# Altium project MCU_board.PrjPcb
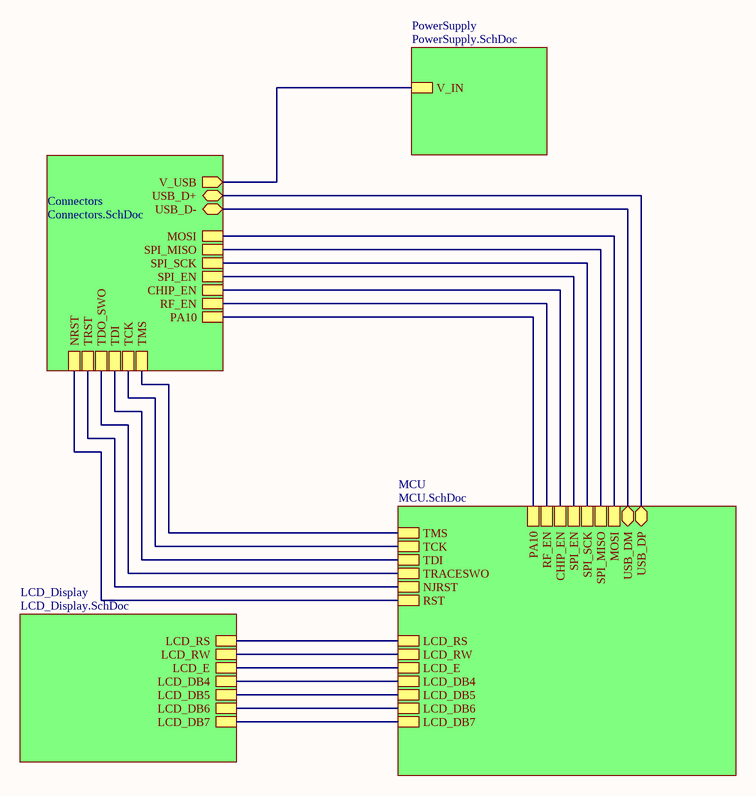
[diagram p0: Board.SchDoc]
5 sheets, 28 parts. Net scope: hierarchical (ports join the sheet entries above them; power ports are global).
Board file: MCU_Board.PcbDoc
Sheets:
  Board.SchDoc
    Connectors = Connectors.SchDoc
    LCD_Display = LCD_Display.SchDoc
    MCU = MCU.SchDoc
    PowerSupply = PowerSupply.SchDoc

## Sheet Board.SchDoc
size A4; SheetNumber: 1; SheetTotal: 5

### Sub-sheets
Connectors = Connectors.SchDoc: USB_D+ (bidir), USB_D- (bidir), V_USB (out), TMS, TCK, TDI, TDO_SWO, TRST, NRST, MOSI, SPI_MISO, SPI_SCK, SPI_EN, CHIP_EN, RF_EN, PA10
LCD_Display = LCD_Display.SchDoc: LCD_RS, LCD_RW, LCD_E, LCD_DB4, LCD_DB6, LCD_DB5, LCD_DB7
MCU = MCU.SchDoc: USB_DM (bidir), USB_DP (bidir), TMS, TCK, TDI, TRACESWO, NJRST, RST, LCD_RS, LCD_RW, LCD_E, LCD_DB4, LCD_DB6, LCD_DB5, LCD_DB7, MOSI, SPI_MISO, SPI_SCK, SPI_EN, CHIP_EN, RF_EN, PA10
PowerSupply = PowerSupply.SchDoc: V_IN

### Nets
USB_N: sheet Connectors/USB_D-, sheet MCU/USB_DM
USB_P: sheet Connectors/USB_D+, sheet MCU/USB_DP
NetC1_2: sheet Connectors/NRST, sheet MCU/RST
NetC13_2: sheet Connectors/V_USB, sheet PowerSupply/V_IN
NetJ1_3: sheet Connectors/TRST, sheet MCU/NJRST
NetJ1_5: sheet Connectors/TDI, sheet MCU/TDI
NetJ1_7: sheet Connectors/TMS, sheet MCU/TMS
NetJ1_9: sheet Connectors/TCK, sheet MCU/TCK
NetJ1_13: sheet Connectors/TDO_SWO, sheet MCU/TRACESWO
NetJ2_1: sheet Connectors/SPI_EN, sheet MCU/SPI_EN
NetJ2_2: sheet Connectors/CHIP_EN, sheet MCU/CHIP_EN
NetJ2_3: sheet Connectors/SPI_SCK, sheet MCU/SPI_SCK
NetJ2_4: sheet Connectors/RF_EN, sheet MCU/RF_EN
NetJ2_5: sheet Connectors/SPI_MISO, sheet MCU/SPI_MISO
NetJ2_6: sheet Connectors/PA10, sheet MCU/PA10
NetJ2_7: sheet Connectors/MOSI, sheet MCU/MOSI
NetU1_3: sheet LCD_Display/LCD_RS, sheet MCU/LCD_RS
NetU1_4: sheet LCD_Display/LCD_RW, sheet MCU/LCD_RW
NetU1_5: sheet LCD_Display/LCD_E, sheet MCU/LCD_E
NetU1_6: sheet LCD_Display/LCD_DB4, sheet MCU/LCD_DB4
NetU1_7: sheet LCD_Display/LCD_DB5, sheet MCU/LCD_DB5
NetU1_8: sheet LCD_Display/LCD_DB6, sheet MCU/LCD_DB6
NetU1_9: sheet LCD_Display/LCD_DB7, sheet MCU/LCD_DB7

## Sheet Connectors.SchDoc
size A4; SheetNumber: 2; SheetTotal: 5
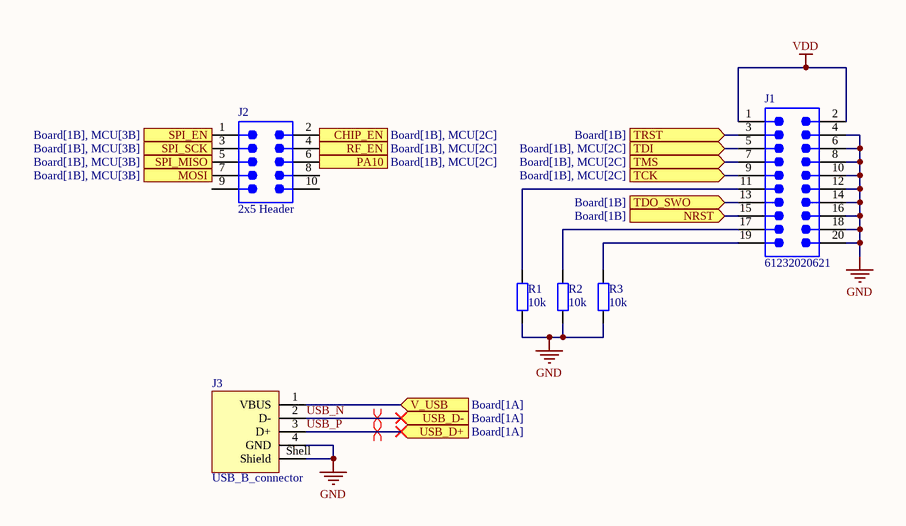
[diagram p1: Connectors.SchDoc]

### Parts
J1  61232020621  [61232020621]
J2  2x5 Header  [SMTC-MMT-105-01-X-DH]
J3  USB_B_connector  [62910416121]
R1  10k  [Res_0402]
R2  10k  [Res_0402]
R3  10k  [Res_0402]

### Ports
CHIP_EN (in, see Board[1B], MCU[2C]), MOSI (in, see Board[1B], MCU[3B]), NRST (in, see Board[1B]), PA10 (in, see Board[1B], MCU[2C]), RF_EN (in, see Board[1B], MCU[2C]), SPI_EN (in, see Board[1B], MCU[3B]), SPI_MISO (in, see Board[1B], MCU[3B]), SPI_SCK (in, see Board[1B], MCU[3B]), TCK (in, see Board[1B], MCU[2C]), TDI (in, see Board[1B], MCU[2C]), TDO_SWO (in, see Board[1B]), TMS (in, see Board[1B], MCU[2C]), TRST (in, see Board[1B]), USB_D+ (in, see Board[1A]), USB_D- (in, see Board[1A]), V_USB (in, see Board[1A])

### Nets
GND: J1.4 J1.6 J1.8 J1.10 J1.12 J1.14 J1.16 J1.18 J1.20 J3.4(GND) J3.Shell(Shield) R1.1 R2.1 R3.1
VDD: J1.1 J1.2
USB_N: J3.2(D-) ; port USB_D-
USB_P: J3.3(D+) ; port USB_D+
NetC1_2: J1.15 ; port NRST
NetC13_2: J3.1(VBUS) ; port V_USB
NetJ1_3: J1.3 ; port TRST
NetJ1_5: J1.5 ; port TDI
NetJ1_7: J1.7 ; port TMS
NetJ1_9: J1.9 ; port TCK
NetJ1_11: J1.11 R1.2
NetJ1_13: J1.13 ; port TDO_SWO
NetJ1_17: J1.17 R2.2
NetJ1_19: J1.19 R3.2
NetJ2_1: J2.1 ; port SPI_EN
NetJ2_2: J2.2 ; port CHIP_EN
NetJ2_3: J2.3 ; port SPI_SCK
NetJ2_4: J2.4 ; port RF_EN
NetJ2_5: J2.5 ; port SPI_MISO
NetJ2_6: J2.6 ; port PA10
NetJ2_7: J2.7 ; port MOSI

Not connected (* = marked no-connect by the designer): J2 8 9 10

### Layout directives
differential pair: USB_N, USB_P

### Library data of the parts
J1 = 2x10 JTAG: NexarPartId: 32855514; Insulation Resistance: 1GΩ; Operating Supply Voltage: 250V; Contact Resistance: 20mΩ; Gender: Male; Current Rating: 3A; Number of Positions: 20; Connector Type: Male Pin; Pitch: 2.54mm; Mount: Surface Mount; Contact Mating Length: 5.0038mm; REACH SVHC: Unknown; Packaging: Tape and Reel; Contact Plating: Gold; Length: 30.72mm; Number of Rows: 2; Color: Black; Termination: Solder; Orientation: Vertical; Max Operating Temperature: 125°C; Contact Material: Copper; Lead Pitch: 2.54mm; Number of Contacts: 20; RoHS: Compliant; Number of Pins: 20; Min Operating Temperature: -40°C; Row Spacing: 2.54mm
J2 = 2x5 Header: Horizontal Surface Mount Header, -55 to 125 degC, 2 mm Pitch, 10-Pin, Male, RoHS; PartNumber: MMT-105-01-F-DH; Manufacturer: Samtec; Pitch: 2 mm; ComponentLink3Description: Package Specification; ComponentLink2URL: http://d2a072wq521u33.cloudfront.net/catalog_english//MMT_SM.PDF; PackageDescription: 2mm Horizontal Terminal Surface Mount Strip ASSEM; ComponentLink1Description: Manufacturer URL; ComponentLink3URL: http://www.samtec.com/documents/webfiles/cpdf/MMT-1XX-XX-XX-XX-XX-XXX-X-XX-MKT.pdf; RoHS: True; ComponentLink2Description: Datasheet; DatasheetVersion: F-214; ComponentLink1URL: http://www.samtec.com; PackageReference: MMT-105-01-X-DH; Mounting Technology: Surface Mount; Temperature Range: -55 to 125 degC; Orientation: Horizontal; PackageVersion: CY, 12/2000
J3 = USB_B_connector: NexarPartId: 19991172; Contact Resistance: 20mΩ; Connector Type: USB; Number of Contacts: 4; Gender: Receptacle; Current Rating: 1.5A; USB Standard: USB 2.0; Operating Supply Voltage: 30V; Insulation Resistance: 1GΩ; Orientation: Horizontal; RoHS: Compliant; Lead Free: Lead Free; Min Operating Temperature: -40°C; Length: 16mm; Number of Pins: 4; Features: Shielded; Contact Plating: Gold; Packaging: Tape and Reel; Max Operating Temperature: 105°C; Termination: SMD/SMT; Mount: Horizontal, Surface Mount; REACH SVHC: Unknown
R1-R3 = Resistor_EU

## Sheet LCD_Display.SchDoc
size A4; SheetNumber: 3; SheetTotal: 5
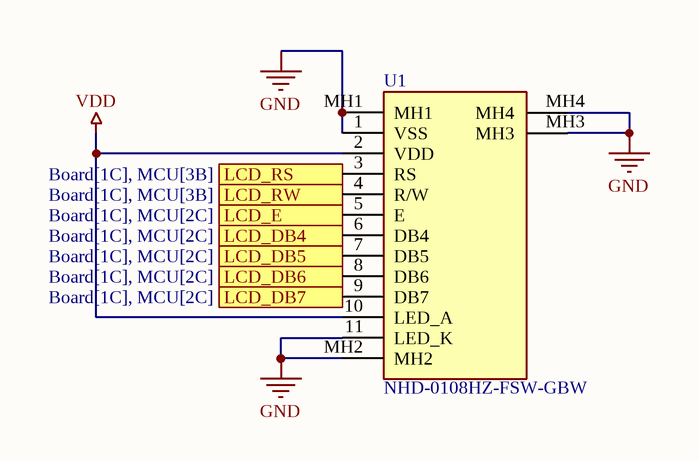
[diagram p2: LCD_Display.SchDoc]

### Parts
U1  NHD-0108HZ-FSW-GBW  [NHD0108HZFSWGBW]

### Ports
LCD_DB4 (in, see Board[1C], MCU[2C]), LCD_DB5 (in, see Board[1C], MCU[2C]), LCD_DB6 (in, see Board[1C], MCU[2C]), LCD_DB7 (in, see Board[1C], MCU[2C]), LCD_E (in, see Board[1C], MCU[2C]), LCD_RS (in, see Board[1C], MCU[3B]), LCD_RW (in, see Board[1C], MCU[3B])

### Nets
GND: U1.1(VSS) U1.11(LED_K) U1.MH1 U1.MH2 U1.MH3 U1.MH4
VDD: U1.2(VDD) U1.10(LED_A)
NetU1_3: U1.3(RS) ; port LCD_RS
NetU1_4: U1.4(R/W) ; port LCD_RW
NetU1_5: U1.5(E) ; port LCD_E
NetU1_6: U1.6(DB4) ; port LCD_DB4
NetU1_7: U1.7(DB5) ; port LCD_DB5
NetU1_8: U1.8(DB6) ; port LCD_DB6
NetU1_9: U1.9(DB7) ; port LCD_DB7

### Library data of the parts
U1 = NHD-0108HZ-FSW-GBW: Display; Manufacturer_Name: Newhaven Display; Datasheet Link: https://componentsearchengine.com/Datasheets/1/NHD-0108HZ-FSW-GBW.pdf; Height: 6.25mm; Manufacturer_Part_Number: NHD-0108HZ-FSW-GBW; Mouser Part Number: 763-0108HZ-FSW-GBW; Mouser Price/Stock: https://www.mouser.co.uk/ProductDetail/Newhaven-Display/NHD-0108HZ-FSW-GBW?qs=3vk7fz9CmNzWmNqjoshRyQ%3D%3D

## Sheet MCU.SchDoc
size A4; SheetNumber: 4; SheetTotal: 5
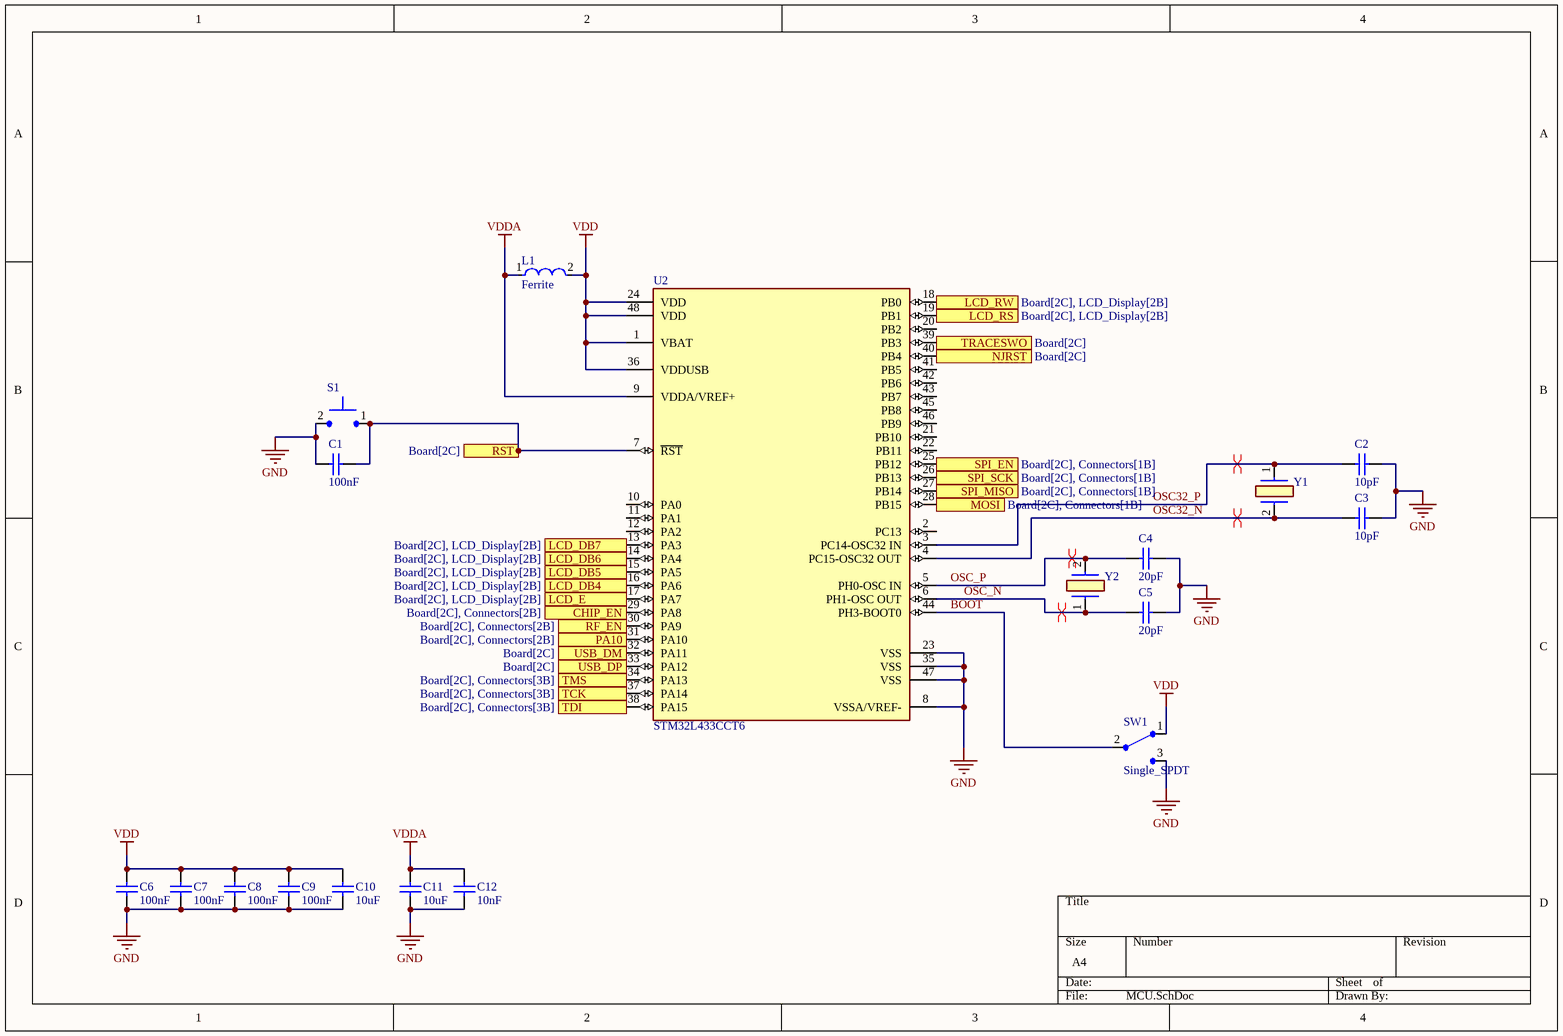
[diagram p3: MCU.SchDoc]

### Parts
C1  100nF  [CAP_0402]
C2  10pF  [CAP_0402]
C3  10pF  [CAP_0402]
C4  20pF  [CAP_0402]
C5  20pF  [CAP_0402]
C6  100nF  [CAP_0402]
C7  100nF  [CAP_0402]
C8  100nF  [CAP_0402]
C9  100nF  [CAP_0402]
C10  10uF  [CAP_0402]
C11  10uF  [CAP_0402]
C12  10nF  [CAP_0402]
L1  Ferrite  [FP-LQW18AN_00-MFG]
S1  Generic 2-pin push button  (value not drawn)
SW1  Single_SPDT
U2  STM32L433CCT6  [FP-LQFP48-5B-MFG]
Y1  ECS-.320-12.5-13X  [ECS32012513X]  (value not drawn)
Y2  NX3225GD-8MHZ-STD-CRA-3  [NX3225GD8MHZSTDCRA3]  (value not drawn)

### Ports
CHIP_EN (in, see Board[2C], Connectors[2B]), LCD_DB4 (in, see Board[2C], LCD_Display[2B]), LCD_DB5 (in, see Board[2C], LCD_Display[2B]), LCD_DB6 (in, see Board[2C], LCD_Display[2B]), LCD_DB7 (in, see Board[2C], LCD_Display[2B]), LCD_E (in, see Board[2C], LCD_Display[2B]), LCD_RS (in, see Board[2C], LCD_Display[2B]), LCD_RW (in, see Board[2C], LCD_Display[2B]), MOSI (in, see Board[2C], Connectors[1B]), NJRST (in, see Board[2C]), PA10 (in, see Board[2C], Connectors[2B]), RF_EN (in, see Board[2C], Connectors[2B]), RST (in, see Board[2C]), SPI_EN (in, see Board[2C], Connectors[1B]), SPI_MISO (in, see Board[2C], Connectors[1B]), SPI_SCK (in, see Board[2C], Connectors[1B]), TCK (in, see Board[2C], Connectors[3B]), TDI (in, see Board[2C], Connectors[3B]), TMS (in, see Board[2C], Connectors[3B]), TRACESWO (in, see Board[2C]), USB_DM (in, see Board[2C]), USB_DP (in, see Board[2C])

### Nets
GND: C1.1 C2.2 C3.2 C4.2 C5.2 C6.1 C7.1 C8.1 C9.1 C10.1 C11.1 C12.1 S1.2 SW1.3 U2.8(VSSA/VREF-) U2.23(VSS) U2.35(VSS) U2.47(VSS)
VDD: C6.2 C7.2 C8.2 C9.2 C10.2 L1.2 SW1.1 U2.1(VBAT) U2.24(VDD) U2.36(VDDUSB) U2.48(VDD)
VDDA: C11.2 C12.2 L1.1 U2.9(VDDA/VREF+)
BOOT: SW1.2 U2.44(PH3-BOOT0)
OSC32_N: C3.1 U2.4(PC15-OSC32_OUT) Y1.2(CRYSTAL_2)
OSC32_P: C2.1 U2.3(PC14-OSC32_IN) Y1.1
OSC_N: C5.1 U2.6(PH1-OSC_OUT) Y2.1
OSC_P: C4.1 U2.5(PH0-OSC_IN) Y2.2
USB_N: U2.32(PA11) ; port USB_DM
USB_P: U2.33(PA12) ; port USB_DP
NetC1_2: C1.2 S1.1 U2.7(~{RST}) ; port RST
NetJ1_3: U2.40(PB4) ; port NJRST
NetJ1_5: U2.38(PA15) ; port TDI
NetJ1_7: U2.34(PA13) ; port TMS
NetJ1_9: U2.37(PA14) ; port TCK
NetJ1_13: U2.39(PB3) ; port TRACESWO
NetJ2_1: U2.25(PB12) ; port SPI_EN
NetJ2_2: U2.29(PA8) ; port CHIP_EN
NetJ2_3: U2.26(PB13) ; port SPI_SCK
NetJ2_4: U2.30(PA9) ; port RF_EN
NetJ2_5: U2.27(PB14) ; port SPI_MISO
NetJ2_6: U2.31(PA10) ; port PA10
NetJ2_7: U2.28(PB15) ; port MOSI
NetU1_3: U2.19(PB1) ; port LCD_RS
NetU1_4: U2.18(PB0) ; port LCD_RW
NetU1_5: U2.17(PA7) ; port LCD_E
NetU1_6: U2.16(PA6) ; port LCD_DB4
NetU1_7: U2.15(PA5) ; port LCD_DB5
NetU1_8: U2.14(PA4) ; port LCD_DB6
NetU1_9: U2.13(PA3) ; port LCD_DB7

Not connected (* = marked no-connect by the designer): U2 2(PC13) 10(PA0) 11(PA1) 12(PA2) 20(PB2) 21(PB10) 22(PB11) 41(PB5) 42(PB6) 43(PB7) 45(PB8) 46(PB9)

### Layout directives
differential pair: OSC32_N, OSC32_P, OSC_N, OSC_P

### Library data of the parts
C1-C12 = Capacitor: Manufacturer: Murata; Part Number: GRM155R71E103KA01D
L1 = Ferrite_bead: Test Frequency: 100MHz; DC Current: 500mA; Current: 400mA; Series Resistance: 170mR; Tolerance: 2%; Core Material: Non-Magnetic; Shielding: Unshielded; Self Resonant Frequency: 4.6GHz; Inductance: 22nH; Q Factor: 40; Weight: 0.000106oz; Military Standard: Not; Case/Package: 0603; Case Code (Metric): 1608; Width: 0.8mm; Length: 1.6mm; Depth: 1mm; REACH SVHC: No SVHC; Case Code (Imperial): 0603; Lead Free: Lead Free; Mount: Surface Mount; Resistor Type: Wirewound; Inductance Tolerance: 2%; Number of Pins: 2; Termination: SMD/SMT; Package Quantity: 4000; Height - Seated (Max): 0.039inch; Height: 0.8mm; Packaging: Tape and Reel; Max DC Current: 500mA; Current Rating: 500mA; Min Operating Temperature: -55°C; DC Resistance (DCR): 170mR; Max Operating Temperature: 125°C
S1 = Push_btn_2pin
U2 = STM32L433CCT6: IC MCU 32BIT 256KB FLASH 48LQFP; Manufacturer: STMicroelectronics; Max Junction Temp: +105°C; Min Supply Voltage: 1.55V; Number Of Uart Channels: 4; Number Of I2C Channels: 3; Max Supply Voltage: 3.6V; Number Of I/Os: 38; Number Of Usb Channels: 1; Memory Size: 256KBytes; Interface: I2C,SPI,UART,USART,CAN,USB,LIN,IrDA,SMBus,Other; Ram Size: 64KBytes; Standoff Height: 0.05mm; Number Of Pwm Channels: 14; Number Of Timers/Counters: 9; Frequency: 80MHz; Data Bus Width: 32bits; Number Of Adc Channels: 10; Core Architecture: Arm Cortex-M4; Digikey Description: IC MCU 32BIT 256KB FLASH 48LQFP; Category: IC; Ambient Temperature Range High: +85°C; Number Of Spi Channels: 3; Temperature Range High: +85°C; ComponentLink2Description: Datasheet; Device Class L3: Microcontrollers; Device Class L2: Embedded Processors and Controllers; Temperature Range Low: -40°C; Ambient Temperature Range Low: -40°C; Manufacturer Part Number: STM32L433CCT6; Automotive: No; Package: LQFP48-5B; Ipc Land Pattern Name: QFP50P900X900X160-48; RoHS: TRUE; Octopart: https://octopart.com/stm32l433cct6-stmicroelectronics-71093511; Number Of A/D Converters: 1; Memory Type: FLASH; Lead Free: Yes; ComponentLink2URL: https://www.st.com/resource/en/datasheet/stm32l433cc.pdf; Device Class L1: Integrated Circuits (ICs); Temperature: -40°C to +85°C; Number Of Cores: 1; Height: 1.6mm
Y1 = ECS-.320-12.5-13X: Crystal or Oscillator; Manufacturer_Name: ECS; Datasheet Link: https://g.componentsearchengine.com/Datasheets/1/ECS-.320-12.5-13X.pdf; Height: 6.2mm; Manufacturer_Part_Number: ECS-.320-12.5-13X; Mouser Part Number: 520-ECS-32-12.5-13X; Mouser Price/Stock: https://www.mouser.co.uk/ProductDetail/ECS/ECS-.320-12.5-13X?qs=aGohqJksTCKD9WVp6G%2FEsQ%3D%3D; Arrow Part Number: ECS-.320-12.5-13X; Arrow Price/Stock: https://www.arrow.com/en/products/ecs-.320-12.5-13x/ecs-international?region=nac
Y2 = NX3225GD-8MHZ-STD-CRA-3: Crystal or Oscillator; Manufacturer_Name: NDK; Datasheet Link: https://th.mouser.com/datasheet/2/905/c_NX3225GD-STD-CRA-3_e-1317534.pdf; Height: 1mm; Manufacturer_Part_Number: NX3225GD-8MHZ-STD-CRA-3; Mouser Part Number: 344-NX3225GD8MCRA3; Mouser Price/Stock: https://www.mouser.co.uk/ProductDetail/NDK/NX3225GD-8MHZ-STD-CRA-3?qs=55YtniHzbhDA0fw3anYH2g%3D%3D

## Sheet PowerSupply.SchDoc
size A4; SheetNumber: 5; SheetTotal: 5
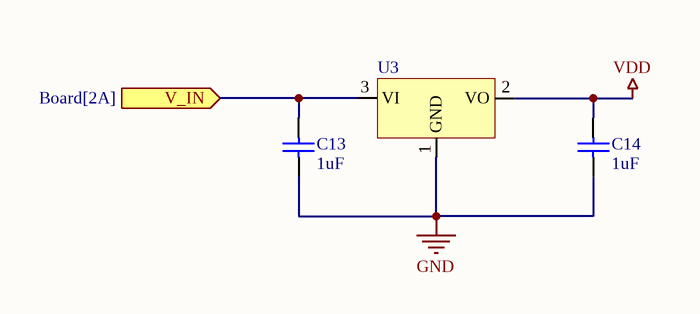
[diagram p4: PowerSupply.SchDoc]

### Parts
C13  1uF  [CAP_0402]
C14  1uF  [CAP_0402]
U3  LDO-Voltage-Regulator-3Pin  [SOT95P237X112-3N]  (value not drawn)

### Ports
V_IN (in, see Board[2A])

### Nets
GND: C13.1 C14.1 U3.1(GND)
VDD: C14.2 U3.2(VO)
NetC13_2: C13.2 U3.3(VI) ; port V_IN

### Library data of the parts
C13 C14 = Capacitor: as C1 on sheet MCU

## Nets that join several sheets
GND: Connectors (14 pins), LCD_Display (6 pins), MCU (18 pins), PowerSupply (C13.1 C14.1 U3.1)
VDD: Connectors (J1.1 J1.2), LCD_Display (U1.2 U1.10), MCU (11 pins), PowerSupply (C14.2 U3.2)
NetC1_2: Connectors (J1.15), MCU (C1.2 S1.1 U2.7)
NetC13_2: Connectors (J3.1), PowerSupply (C13.2 U3.3)
NetJ1_3: Connectors (J1.3), MCU (U2.40)
NetJ1_5: Connectors (J1.5), MCU (U2.38)
NetJ1_7: Connectors (J1.7), MCU (U2.34)
NetJ1_9: Connectors (J1.9), MCU (U2.37)
NetJ1_13: Connectors (J1.13), MCU (U2.39)
NetJ2_1: Connectors (J2.1), MCU (U2.25)
NetJ2_2: Connectors (J2.2), MCU (U2.29)
NetJ2_3: Connectors (J2.3), MCU (U2.26)
NetJ2_4: Connectors (J2.4), MCU (U2.30)
NetJ2_5: Connectors (J2.5), MCU (U2.27)
NetJ2_6: Connectors (J2.6), MCU (U2.31)
NetJ2_7: Connectors (J2.7), MCU (U2.28)
NetU1_3: LCD_Display (U1.3), MCU (U2.19)
NetU1_4: LCD_Display (U1.4), MCU (U2.18)
NetU1_5: LCD_Display (U1.5), MCU (U2.17)
NetU1_6: LCD_Display (U1.6), MCU (U2.16)
NetU1_7: LCD_Display (U1.7), MCU (U2.15)
NetU1_8: LCD_Display (U1.8), MCU (U2.14)
NetU1_9: LCD_Display (U1.9), MCU (U2.13)
USB_N: Connectors (J3.2), MCU (U2.32)
USB_P: Connectors (J3.3), MCU (U2.33)